# Altium schematic sheet FPGA_Power.SchDoc
size A4
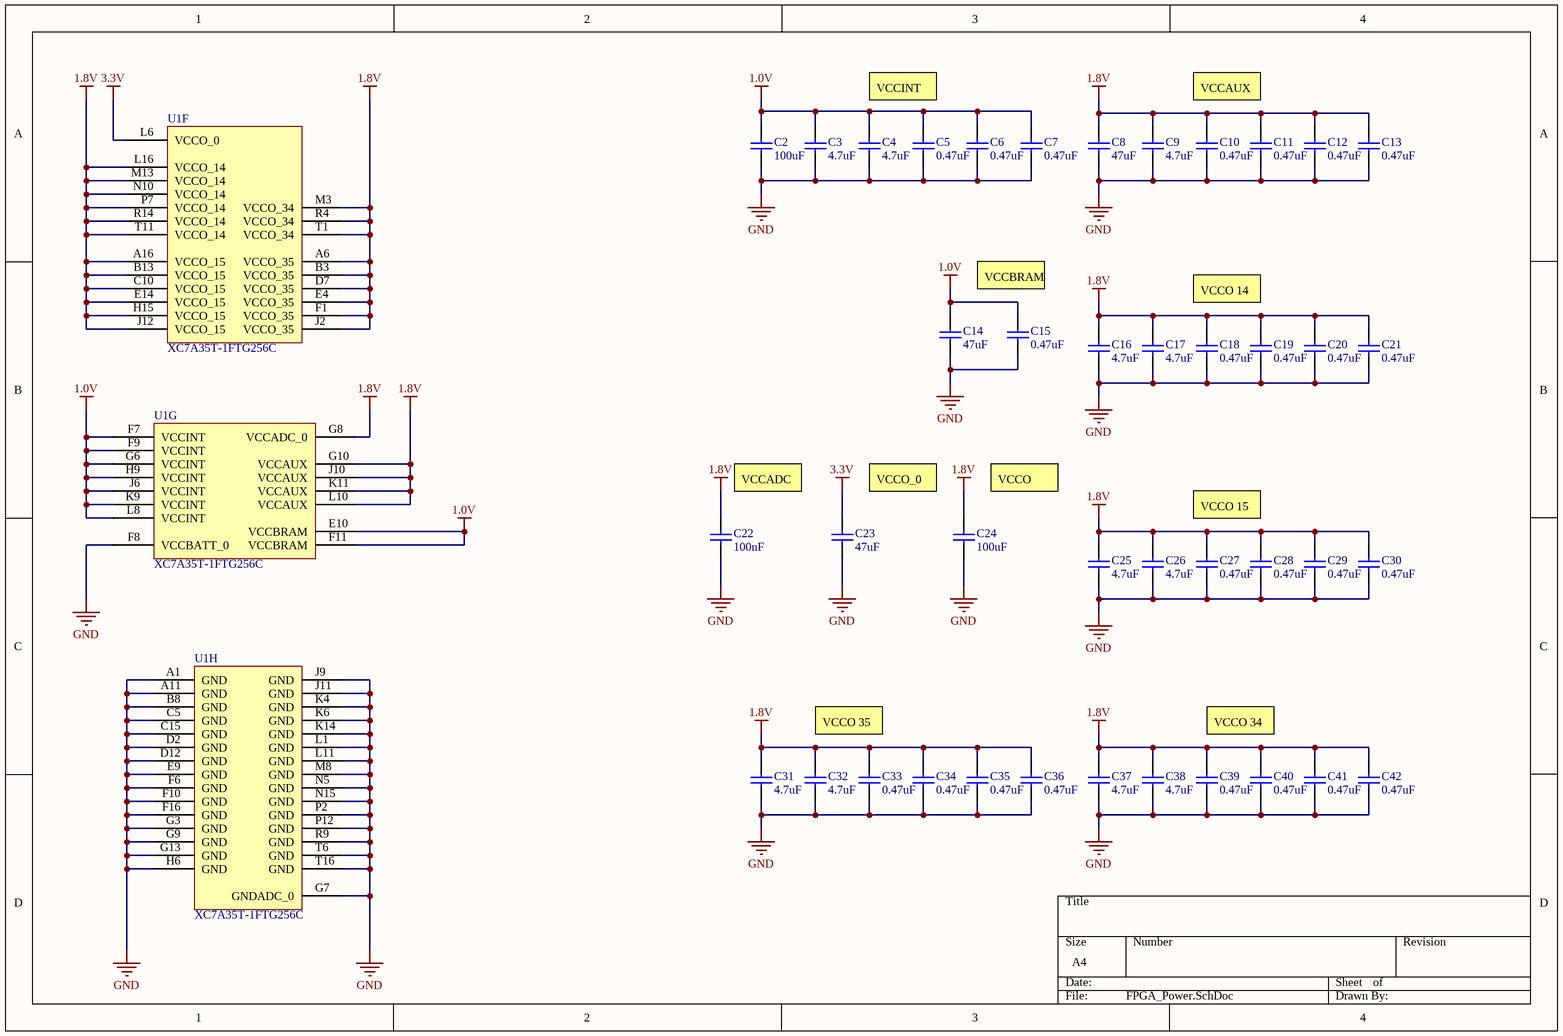
[diagram p0: FPGA_Power.SchDoc]

## Parts
C2  100uF  [CAP1206]
C3  4.7uF  [CAP1206]
C4  4.7uF  [CAP1206]
C5  0.47uF  [CAP1206]
C6  0.47uF  [CAP1206]
C7  0.47uF  [CAP1206]
C8  47uF  [CAP1206]
C9  4.7uF  [CAP1206]
C10  0.47uF  [CAP1206]
C11  0.47uF  [CAP1206]
C12  0.47uF  [CAP1206]
C13  0.47uF  [CAP1206]
C14  47uF  [CAP1206]
C15  0.47uF  [CAP1206]
C16  4.7uF  [CAP1206]
C17  4.7uF  [CAP1206]
C18  0.47uF  [CAP1206]
C19  0.47uF  [CAP1206]
C20  0.47uF  [CAP1206]
C21  0.47uF  [CAP1206]
C22  100nF  [CAP1206]
C23  47uF  [CAP1206]
C24  100uF  [CAP1206]
C25  4.7uF  [CAP1206]
C26  4.7uF  [CAP1206]
C27  0.47uF  [CAP1206]
C28  0.47uF  [CAP1206]
C29  0.47uF  [CAP1206]
C30  0.47uF  [CAP1206]
C31  4.7uF  [CAP1206]
C32  4.7uF  [CAP1206]
C33  0.47uF  [CAP1206]
C34  0.47uF  [CAP1206]
C35  0.47uF  [CAP1206]
C36  0.47uF  [CAP1206]
C37  4.7uF  [CAP1206]
C38  4.7uF  [CAP1206]
C39  0.47uF  [CAP1206]
C40  0.47uF  [CAP1206]
C41  0.47uF  [CAP1206]
C42  0.47uF  [CAP1206]
U1  XC7A35T-1FTG256C  [FTG256]  (parts F,G,H of 8)

## Nets
1.0V: C2.1 C3.1 C4.1 C5.1 C6.1 C7.1 C14.1 C15.1 U1.E10(VCCBRAM) U1.F7(VCCINT) U1.F9(VCCINT) U1.F11(VCCBRAM) U1.G6(VCCINT) U1.H9(VCCINT) U1.J6(VCCINT) U1.K9(VCCINT) U1.L8(VCCINT)
1.8V: C8.1 C9.1 C10.1 C11.1 C12.1 C13.1 C16.1 C17.1 C18.1 C19.1 C20.1 C21.1 C22.1 C24.1 C25.1 C26.1 C27.1 C28.1 C29.1 C30.1 C31.1 C32.1 C33.1 C34.1 C35.1 C36.1 C37.1 C38.1 C39.1 C40.1 C41.1 C42.1 U1.A6(VCCO_35) U1.A16(VCCO_15) U1.B3(VCCO_35) U1.B13(VCCO_15) U1.C10(VCCO_15) U1.D7(VCCO_35) U1.E4(VCCO_35) U1.E14(VCCO_15) U1.F1(VCCO_35) U1.G8(VCCADC_0) U1.G10(VCCAUX) U1.H15(VCCO_15) U1.J2(VCCO_35) U1.J10(VCCAUX) U1.J12(VCCO_15) U1.K11(VCCAUX) U1.L10(VCCAUX) U1.L16(VCCO_14) U1.M3(VCCO_34) U1.M13(VCCO_14) U1.N10(VCCO_14) U1.P7(VCCO_14) U1.R4(VCCO_34) U1.R14(VCCO_14) U1.T1(VCCO_34) U1.T11(VCCO_14)
3.3V: C23.1 U1.L6(VCCO_0)
GND: C2.2 C3.2 C4.2 C5.2 C6.2 C7.2 C8.2 C9.2 C10.2 C11.2 C12.2 C13.2 C14.2 C15.2 C16.2 C17.2 C18.2 C19.2 C20.2 C21.2 C22.2 C23.2 C24.2 C25.2 C26.2 C27.2 C28.2 C29.2 C30.2 C31.2 C32.2 C33.2 C34.2 C35.2 C36.2 C37.2 C38.2 C39.2 C40.2 C41.2 C42.2 U1.A1(GND) U1.A11(GND) U1.B8(GND) U1.C5(GND) U1.C15(GND) U1.D2(GND) U1.D12(GND) U1.E9(GND) U1.F6(GND) U1.F8(VCCBATT_0) U1.F10(GND) U1.F16(GND) U1.G3(GND) U1.G7(GNDADC_0) U1.G9(GND) U1.G13(GND) U1.H6(GND) U1.J9(GND) U1.J11(GND) U1.K4(GND) U1.K6(GND) U1.K14(GND) U1.L1(GND) U1.L11(GND) U1.M8(GND) U1.N5(GND) U1.N15(GND) U1.P2(GND) U1.P12(GND) U1.R9(GND) U1.T6(GND) U1.T16(GND)

## Notes on the sheet
- VCCINT
- VCCAUX
- VCCBRAM
- VCCO 14
- VCCADC
- VCCO_0
- (near C24) VCCO
- VCCO 15
- VCCO 35
- VCCO 34

## Library data of the parts
C2-C42 = Cap_1206: part number: GRM32ER60J107ME20L
  C2 C24: Value: 100uF
  C3 C4 C9 C16 C17 C25 C26 C31 C32 C37 C38: Value: 4.7uF
  C5-C7 C10-C13 C15 C18-C21 C27-C30 C33-C36 C39-C42: Value: 0.47uF
  C8 C14 C23: Value: 47uF
  C22: Value: 100nF
U1 = XC7A35T-1FTG256C: Artix-7 FPGA, 170 User I/Os, 0 GTP, 256-Ball BGA, Speed Grade 1, Commercial Grade, Pb-Free; Manufacturer: Xilinx; Total Block RAM: 1800 Kb; GTP: 0; Clock Mgmt Tiles (CMTs): 5; Logic Cells: 33280; Available User I/O: 170; Speed Grades: 1; DatasheetVersion: v1.15; PackageVersion: Rev. 1.11; PackageReference: FTG-256; PackageDescription: 256-Ball Wire-Bond Fine-Pitch Thin BGA, Body 17 x 17 mm, Pitch 1 mm; Maximum Distributed RAM: 400 Kb; Operating Temperature Range: Commercial; NexusDeviceID: XC7A35T-1FTG256C; Mounting Technology: Surface Mount; PartNumber: XC7A35T-1FTG256C; ComponentLink1Description: Manufacturer URL; ComponentLink1URL: http://www.xilinx.com/; ComponentLink2Description: Datasheet; ComponentLink2URL: http://www.xilinx.com/support/documentation/data_sheets/ds180_7Series_Overview.pdf; ComponentLink3Description: Package Specification; ComponentLink3URL: http://www.xilinx.com/support/documentation/user_guides/ug475_7Series_Pkg_Pinout.pdf; ComponentLink4Description: DC and Switching Characteristics; ComponentLink4URL: http://www.xilinx.com/support/documentation/data_sheets/ds181_Artix_7_Data_Sheet.pdf; ComponentLink5Description: Package File; ComponentLink5URL: http://www.xilinx.com/support/packagefiles/a7packages/xc7a200tsbg484pkg.txt; ComponentLink6Description: Packaging and Pinout; ComponentLink6URL: http://www.xilinx.com/support/documentation/user_guides/ug475_7Series_Pkg_Pinout.pdf